# Altium schematic sheet Sensorkort.SchDoc: TTK8 Sensorkort
size A3; Author: Johan Vårlid; DrawnBy: Johan Vårlid; Engineer: Johan Vårlid; Organization: Omega Verksted; Revision: 1; SheetNumber: 1; SheetTotal: 3
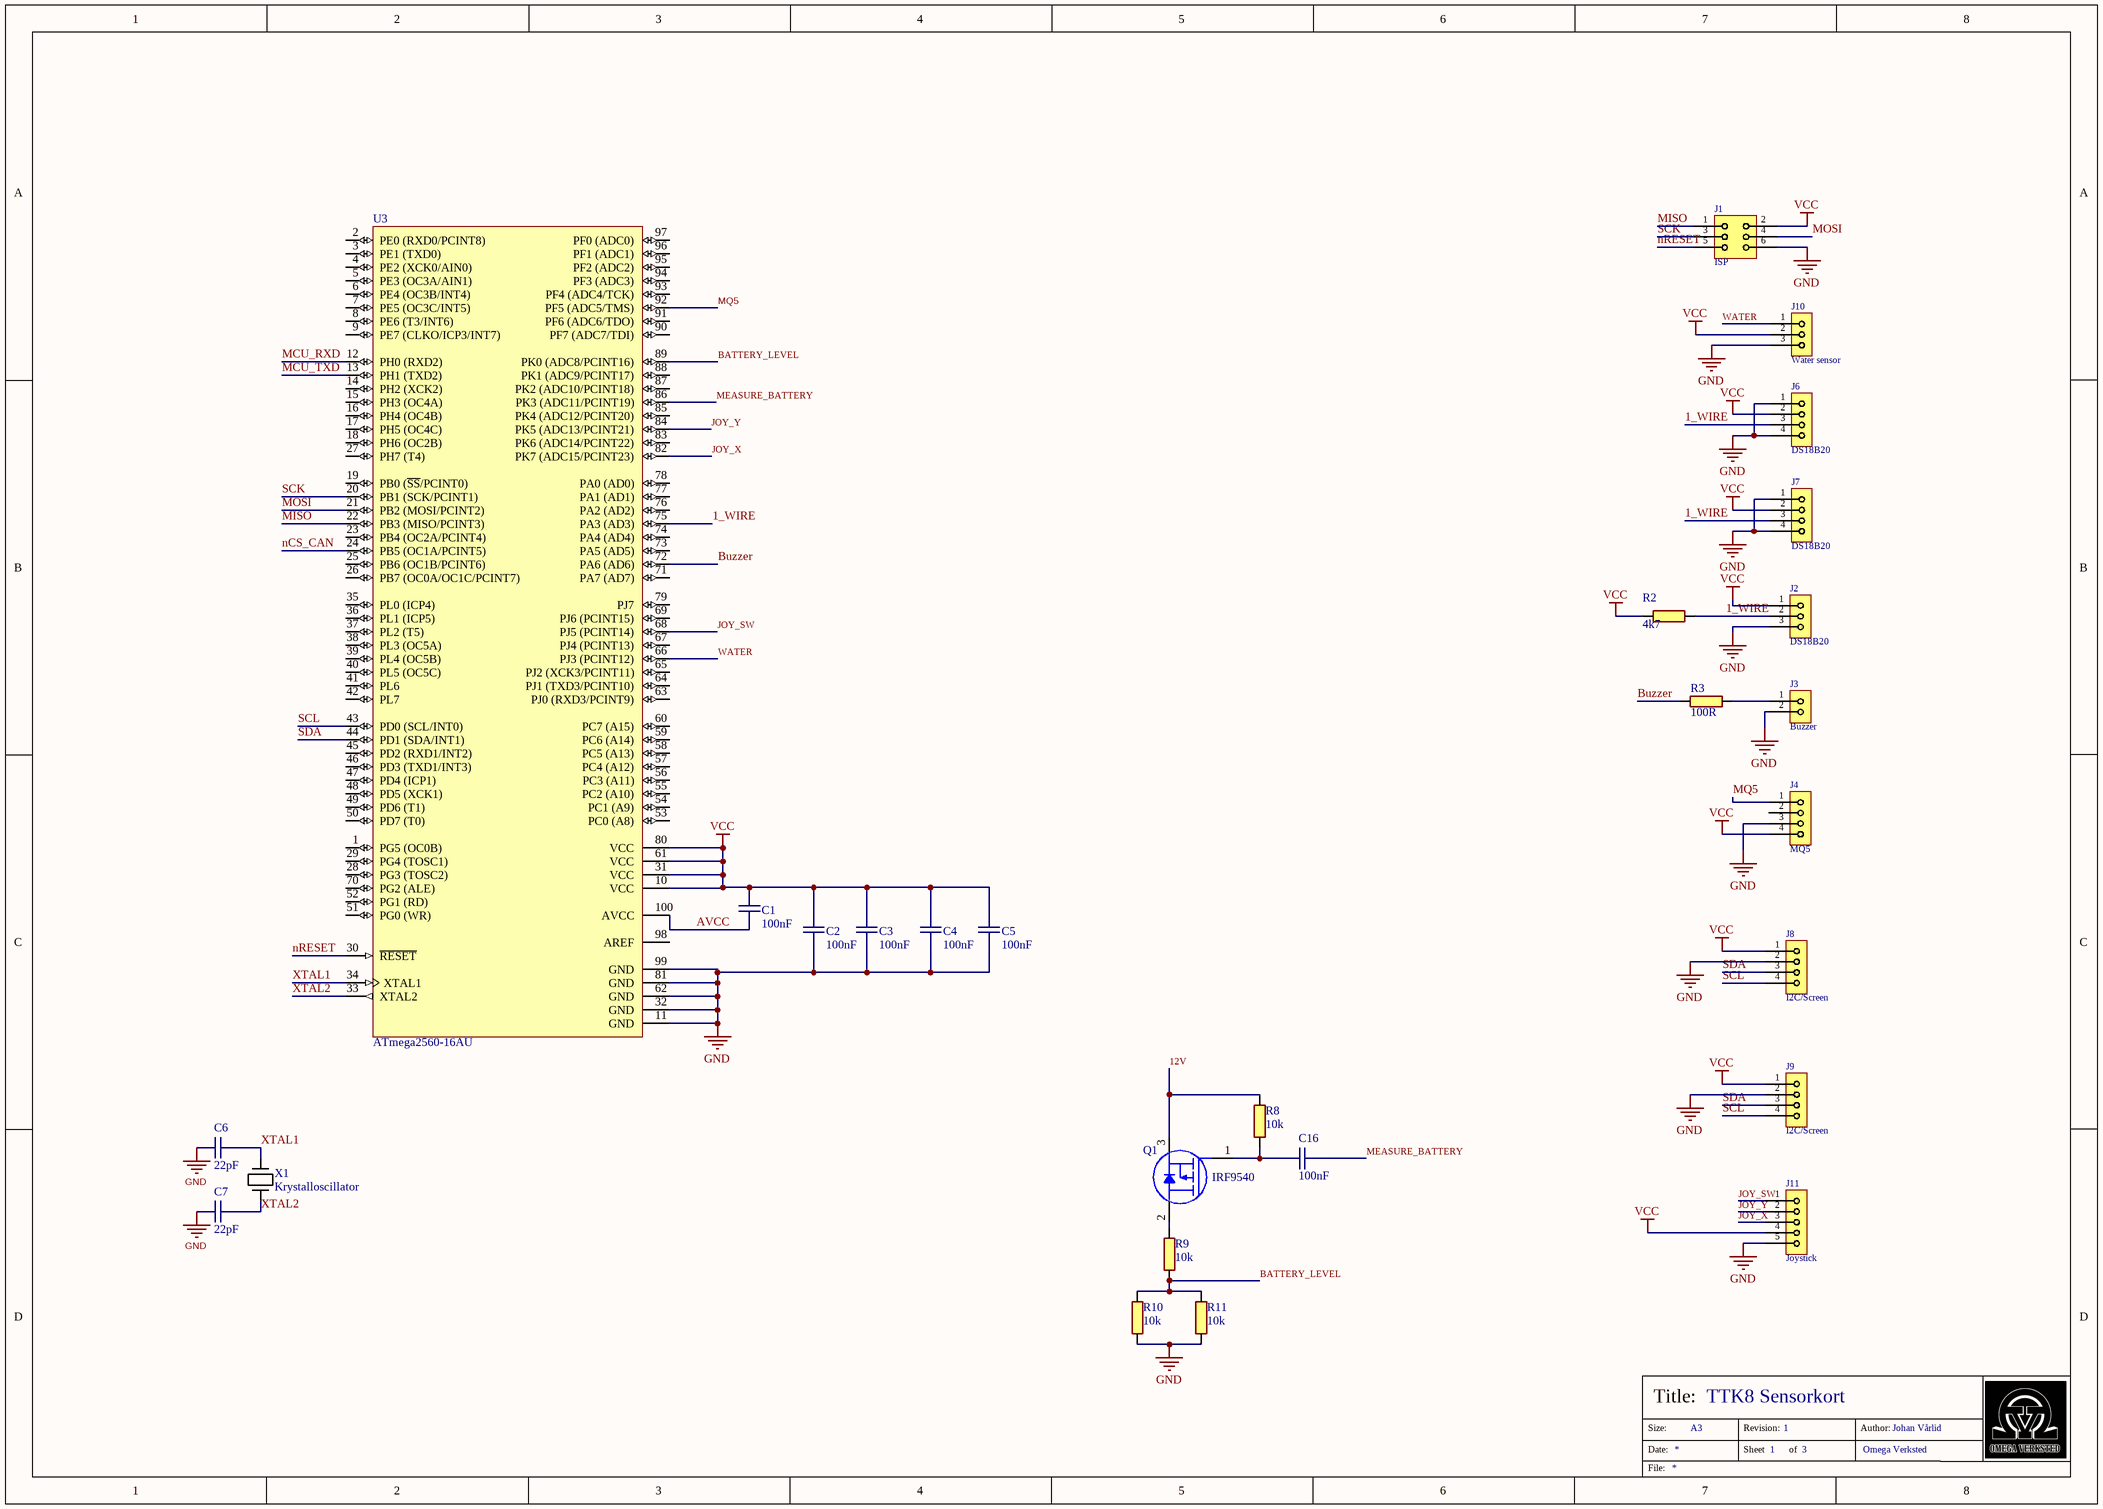
[diagram p0: Sensorkort.SchDoc]

## Parts
C1  100nF  [CAPC0603(1608)55_N]
C2  100nF  [CAPC0603(1608)55_N]
C3  100nF  [CAPC0603(1608)55_N]
C4  100nF  [CAPC0603(1608)55_N]
C5  100nF  [CAPC0603(1608)55_N]
C6  22pF  [CAPC0603(1608)55_N]
C7  22pF  [CAPC0603(1608)55_N]
C16  100nF  [CAPC0603(1608)55_N]
J1  ISP  [HDRV6W64P254_2X3_762X508X900B]
J2  DS18B20  [HDRV3W64P254_1X3_762X254X900B]
J3  Buzzer  [HDRV2W64P254_1X2_508X254X900B]
J4  MQ5  [HDRV4W64P254_1X4_1016X254X900B]
J6  DS18B20  [CTB932HD_4]
J7  DS18B20  [CTB932HD_4]
J8  I2C/Screen  [HDRV4W64P254_1X4_1016X254X900B]
J9  I2C/Screen  [HDRV4W64P254_1X4_1016X254X900B]
J10  Water sensor  [HDRV3W64P254_1X3_762X254X900B]
J11  Joystick  [HDRV5W64P254_1X5_1270X254X900B]
Q1  IRF9540  [TO-220-3P]
R2  4k7  [RESC0603(1608)_N]
R3  100R  [RESC0603(1608)_N]
R8  10k  [RESC0603(1608)_N]
R9  10k  [RESC0603(1608)_N]
R10  10k  [RESC0603(1608)_N]
R11  10k  [RESC0603(1608)_N]
U3  ATmega2560-16AU  [100A_N]
X1  Krystalloscillator  [CrystalTH]

## Nets
GND: C2.1 C3.1 C4.1 C5.1 C6.2 C7.1 J1.6 J2.3 J3.2 J4.3 J6.1 J6.4 J7.1 J7.4 J8.2 J9.2 J10.3 J11.5 R10.1 R11.1 U3.11(GND) U3.32(GND) U3.62(GND) U3.81(GND) U3.99(GND)
VCC: C1.1 C2.2 C3.2 C4.2 C5.2 J1.2 J2.1 J4.4 J6.2 J7.2 J8.1 J9.1 J10.2 J11.4 R2.1 U3.10(VCC) U3.31(VCC) U3.61(VCC) U3.80(VCC)
1_WIRE: J2.2 J6.3 J7.3 R2.2 U3.75(PA3_(AD3))
12V: Q1.3(Drain) R8.2
AVCC: C1.2 U3.100(AVCC)
BATTERY_LEVEL: R9.1 R10.2 R11.2 U3.89(PK0_(ADC8/PCINT16))
Buzzer: R3.1 U3.72(PA6_(AD6))
JOY_SW: J11.1 U3.68(PJ5_(PCINT14))
JOY_X: J11.3 U3.82(PK7_(ADC15/PCINT23))
JOY_Y: J11.2 U3.84(PK5_(ADC13/PCINT21))
MCU_RXD: U3.12(PH0_(RXD2))
MCU_TXD: U3.13(PH1_(TXD2))
MEASURE_BATTERY: C16.2 U3.86(PK3_(ADC11/PCINT19))
MISO: J1.1 U3.22(PB3_(MISO/PCINT3))
MOSI: J1.4 U3.21(PB2_(MOSI/PCINT2))
MQ5: J4.1 U3.92(PF5_(ADC5/TMS))
nCS_CAN: U3.24(PB5_(OC1A/PCINT5))
nRESET: J1.5 U3.30(~{RESET})
SCK: J1.3 U3.20(PB1_(SCK/PCINT1))
SCL: J8.4 J9.4 U3.43(PD0_(SCL/INT0))
SDA: J8.3 J9.3 U3.44(PD1_(SDA/INT1))
WATER: J10.1 U3.66(PJ3_(PCINT12))
XTAL1: C6.1 U3.34(XTAL1) X1.1
XTAL2: C7.2 U3.33(XTAL2) X1.2
NetC16_1: C16.1 Q1.1(Gate) R8.1
NetJ3_1: J3.1 R3.2
NetQ1_2: Q1.2(Source) R9.2

Not connected (* = marked no-connect by the designer): J4 2; U3 1(PG5_(OC0B)) 2(PE0_(RXD0/PCINT8)) 3(PE1_(TXD0)) 4(PE2_(XCK0/AIN0)) 5(PE3_(OC3A/AIN1)) 6(PE4_(OC3B/INT4)) 7(PE5_(OC3C/INT5)) 8(PE6_(T3/INT6)) 9(PE7_(CLKO/ICP3/INT7)) 14(PH2_(XCK2)) 15(PH3_(OC4A)) 16(PH4_(OC4B)) 17(PH5_(OC4C)) 18(PH6_(OC2B)) 19(PB0_(~{SS}/PCINT0)) 23(PB4_(OC2A/PCINT4)) 25(PB6_(OC1B/PCINT6)) 26(PB7_(OC0A/OC1C/PCINT7)) 27(PH7_(T4)) 28(PG3_(TOSC2)) 29(PG4_(TOSC1)) 35(PL0_(ICP4)) 36(PL1_(ICP5)) 37(PL2_(T5)) 38(PL3_(OC5A)) 39(PL4_(OC5B)) 40(PL5_(OC5C)) 41(PL6) 42(PL7) 45(PD2_(RXD1/INT2)) 46(PD3_(TXD1/INT3)) 47(PD4_(ICP1)) 48(PD5_(XCK1)) 49(PD6_(T1)) 50(PD7_(T0)) 51(PG0_(WR)) 52(PG1_(RD)) 53(PC0_(A8)) 54(PC1_(A9)) 55(PC2_(A10)) 56(PC3_(A11)) 57(PC4_(A12)) 58(PC5_(A13)) 59(PC6_(A14)) 60(PC7_(A15)) 63(PJ0_(RXD3/PCINT9)) 64(PJ1_(TXD3/PCINT10)) 65(PJ2_(XCK3/PCINT11)) 67(PJ4_(PCINT13)) 69(PJ6_(PCINT15)) 70(PG2_(ALE)) 71(PA7_(AD7)) 73(PA5_(AD5)) 74(PA4_(AD4)) 76(PA2_(AD2)) 77(PA1_(AD1)) 78(PA0_(AD0)) 79(PJ7) 83(PK6_(ADC14/PCINT22)) 85(PK4_(ADC12/PCINT20)) 87(PK2_(ADC10/PCINT18)) 88(PK1_(ADC9/PCINT17)) 90(PF7_(ADC7/TDI)) 91(PF6_(ADC6/TDO)) 93(PF4_(ADC4/TCK)) 94(PF3_(ADC3)) 95(PF2_(ADC2)) 96(PF1_(ADC1)) 97(PF0_(ADC0)) 98(AREF)

## Notes on the sheet
- Size:
- Date:
- Title:
- A3
- Revision:
- Sheet
- of
- Author:
- File:

## Library data of the parts
C1-C5 = 3028: X7R 50V 5%; id: 3028; pakke_opprettet_av: 815; leverandor_varenr: 1759122; pris: 1; nokkelord: Kondensator, Capacitor, CAP; produsent: Multikomp; leverandor: Farnell; pakketype: 0603; pakke_opprettet: 18.02.2015 14:18:13; symbol_opprettet_av: 815; symbol_opprettet: 14.11.2014 20:19:34; navn: 100nF
C6 C7 = 3934: Capacitor; id: 3934; pakke_opprettet_av: 815; pris: 0; nokkelord: kondensator; pakketype: 0603; pakke_opprettet: 18.02.2015 14:18:13; symbol_opprettet_av: 815; symbol_opprettet: 14.11.2014 20:19:34; navn: 22pF
C16 = 3028: X7R 50V 5%; id: 3028; pakke_opprettet_av: 815; pakke_opprettet: 18.02.2015 14.18.13; symbol_opprettet: 14.11.2014 20.19.34; leverandor_varenr: 1759122; pris: 1; nokkelord: Kondensator, Capacitor, CAP; produsent: Multikomp; leverandor: Farnell; pakketype: 0603; symbol_opprettet_av: 815; navn: 100nF
J1 = 3187: id: 3187; pakke_opprettet_av: 815; pakke_opprettet: 23.07.2015 20.17.54; symbol_opprettet: 13.11.2014 11.03.43; beskrivelse: 2,54mm pitch; navn: Header 2x3; pris: 3; pakketype: TH; symbol_opprettet_av: 815
J2 J10 = 2430: id: 2430; pakke_opprettet_av: 815; pakke_opprettet: 13.11.2014 12.31.03; symbol_opprettet: 13.11.2014 10.59.05; beskrivelse: 2,54mm pitch; navn: Header 1x3; pris: 2; pakketype: TH; symbol_opprettet_av: 815
J3 = 2429: id: 2429; pakke_opprettet_av: 815; pakke_opprettet: 13.11.2014 12.30.48; symbol_opprettet: 13.11.2014 10.58.53; beskrivelse: 2,54mm pitch; navn: Header 1x2; pris: 1; pakketype: TH; symbol_opprettet_av: 815
J4 J8 J9 = 2431: id: 2431; pakke_opprettet_av: 815; pakke_opprettet: 13.11.2014 12.31.18; symbol_opprettet: 13.11.2014 10.59.12; beskrivelse: 2,54mm pitch; navn: Header 1x4; pris: 2; pakketype: TH; symbol_opprettet_av: 815
J6 J7 = 2281: id: 2281; rad: 21; rom: GM; lager_type: Baklager; dybde: 8; hylle: 0; antall: 200; pakke_opprettet_av: 1150; pakke_opprettet: 31.05.2017 20.51.00; symbol_opprettet_av: 815; symbol_opprettet: 13.11.2014 10.59.12; beskrivelse: Skruplint; leverandor_varenr: 2493648 / 2493679; navn: Pluggbar skrukobling x4; pris: 9; nokkelord: Terminal Block; produsent: Camdenboss; leverandor: Farnell; pakketype: TH; kolonne: 0
J11 = 2432: id: 2432; pakke_opprettet_av: 815; pakke_opprettet: 13.11.2014 12.31.31; symbol_opprettet: 13.11.2014 10.59.18; beskrivelse: 2,54mm pitch; navn: Header 1x5; pris: 3; pakketype: TH; symbol_opprettet_av: 815
Q1 = 1529: MOSFET P-Kanal; id: 1529; rad: 0; rom: GM; lager_type: Baklager; hylle: 600; antall: 1000; pakke_opprettet_av: 815; pakke_opprettet: 09.06.2015 21.08.41; symbol_opprettet_av: 1150; symbol_opprettet: 14.09.2016 17.38.26; leverandor_varenr: 8648620; pris: 15; produsent: Infineon; leverandor: Farnell; pakketype: TO-220; Status: New; dybde: 0; kolonne: 0; navn: IRF9540
R2 = 3457: 0.1W 1% Thick film resistor; id: 3457; rad: -1; rom: OV; lager_type: Fremlager; dybde: 64; hylle: 3; antall: 100; kolonne: 0; pakke_opprettet_av: 815; pakke_opprettet: 08.07.2014 21.15.30; symbol_opprettet: 08.07.2014 21.16.33; pakketype: 0603; symbol_opprettet_av: 815; navn: 4k7; pris: 0
R3 = 3416: 0.1W 1% Thick film resistor; id: 3416; rad: -1; rom: OV; lager_type: Fremlager; dybde: 24; hylle: 3; antall: 100; kolonne: 0; pakke_opprettet_av: 815; pakke_opprettet: 08.07.2014 21.15.30; symbol_opprettet: 08.07.2014 21.16.33; pakketype: 0603; symbol_opprettet_av: 815; navn: 100R; pris: 0
R8-R11 = 2444: 0.1W 1% Thick film resistor; id: 2444; rad: 21; rom: GM; lager_type: Baklager; dybde: 1; hylle: 0; antall: 3500; pakke_opprettet_av: 815; pakke_opprettet: 08.07.2014 21.15.30; symbol_opprettet: 08.07.2014 21.16.33; leverandor_varenr: 2447230; nokkelord: Resistor Motstand; produsent: Multikomp; leverandor: Farnell; pakketype: 0603; kolonne: 0; symbol_opprettet_av: 815; navn: 10k; pris: 0
U3 = ATmega2560-16AU: 8-bit AVR Microcontroller, 4.5-5.5V, 256KB Flash, 4KB EEPROM, 8KB SRAM, 86 GPIO pins, 100-pin TQFP, Industrial Grade (-40°C to 85°C), Pb-Free; Published: 1-Apr-2010; DatasheetVersion: revL, Aug-2007; PackageVersion: revC, Oct-2001; PackageReference: 100A; Publisher: Altium Limited; PackageDescription: 100-Pin Thin Profile Plastic Quad Flat Pack (TQFP), 14 x 14 x 1.0 mm Body, 0.5 mm Pitch; Supplier 1: Digi-Key; Supplier Part Number 1: ATMEGA2560-16AU-ND; Supplier 2: Farnell; Supplier Part Number 2: 1288330; Supplier 3: Farnell; Supplier Part Number 3: 1661740; Supplier 4: Mouser; Supplier Part Number 4: 556-ATMEGA2560-16AU; Code_JEDEC: MS-026-AED; ComponentLink1Description: Manufacturer Link; ComponentLink1URL: http://www.atmel.com/products/avr/default.asp?; ComponentLink2Description: ATmega640/1280/1281/2560/2561 Datasheet; ComponentLink2URL: http://www.atmel.com/dyn/resources/prod_documents/doc2549.pdf; ComponentLink3Description: ATmega640/1280/1281/2560/2561 Summary; ComponentLink3URL: http://www.atmel.com/dyn/resources/prod_documents/2549S.pdf; ComponentLink4Description: Atmel.com Home; ComponentLink4URL: http://www.atmel.com
X1 = 3915: 4MHz; id: 3915; rad: 0; rom: OV; lager_type: Fremlager; hylle: 7; antall: 30; kolonne: 1; pakke_opprettet_av: 1150; symbol_opprettet_av: 774; pris: 2; nokkelord: krystall, crystal, oscillator; pakketype: TH; dybde: 0; pakke_opprettet: 29.01.2017 21:01:52; symbol_opprettet: 23.08.2014 20:23:20; navn: Krystalloscillator